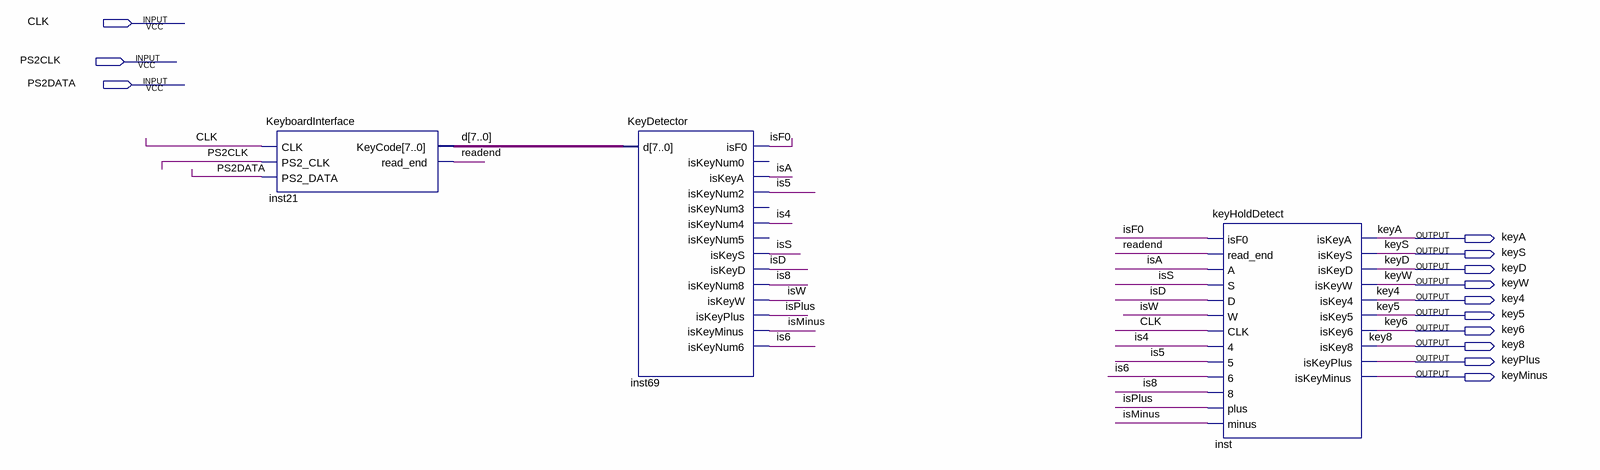
[diagram p0: schematic sheet]
// Quartus schematic tastatura.bdf as structural Verilog: 3 symbols, 13 pins
module tastatura (
  input  CLK,
  input  PS2CLK,
  input  PS2DATA,
  output keyA,
  output keyS,
  output keyD,
  output keyW,
  output key4,
  output key5,
  output key6,
  output key8,
  output keyPlus,
  output keyMinus
);

  wire is4, is5, is6, is8, isA, isD, isF0, isMinus, isPlus, isS, isW, readend;
  wire [7:0] d;

  KeyboardInterface inst21 (.CLK(CLK), .PS2_CLK(PS2CLK), .PS2_DATA(PS2DATA), .KeyCode(d), .read_end(readend));
  KeyDetector inst69 (
    .d(d), .isF0(isF0), .isKeyA(isA), .isKeyNum2(is5), .isKeyNum4(is4), .isKeyS(isS), .isKeyD(isD),
    .isKeyNum8(is8), .isKeyW(isW), .isKeyPlus(isPlus), .isKeyMinus(isMinus), .isKeyNum6(is6));  // open: isKeyNum0, isKeyNum3, isKeyNum5
  keyHoldDetect inst (
    .isF0(isF0), .read_end(readend), .A(isA), .S(isS), .D(isD), .W(isW), .CLK(CLK), .\4 (is4), .\5 (is5),
    .\6 (is6), .\8 (is8), .plus(isPlus), .minus(isMinus), .isKeyA(keyA), .isKeyS(keyS), .isKeyD(keyD),
    .isKeyW(keyW), .isKey4(key4), .isKey5(key5), .isKey6(key6), .isKey8(key8), .isKeyPlus(keyPlus),
    .isKeyMinus(keyMinus));
endmodule
